# EAGLE schematic smartcardemu (EAGLE 6.5.0)
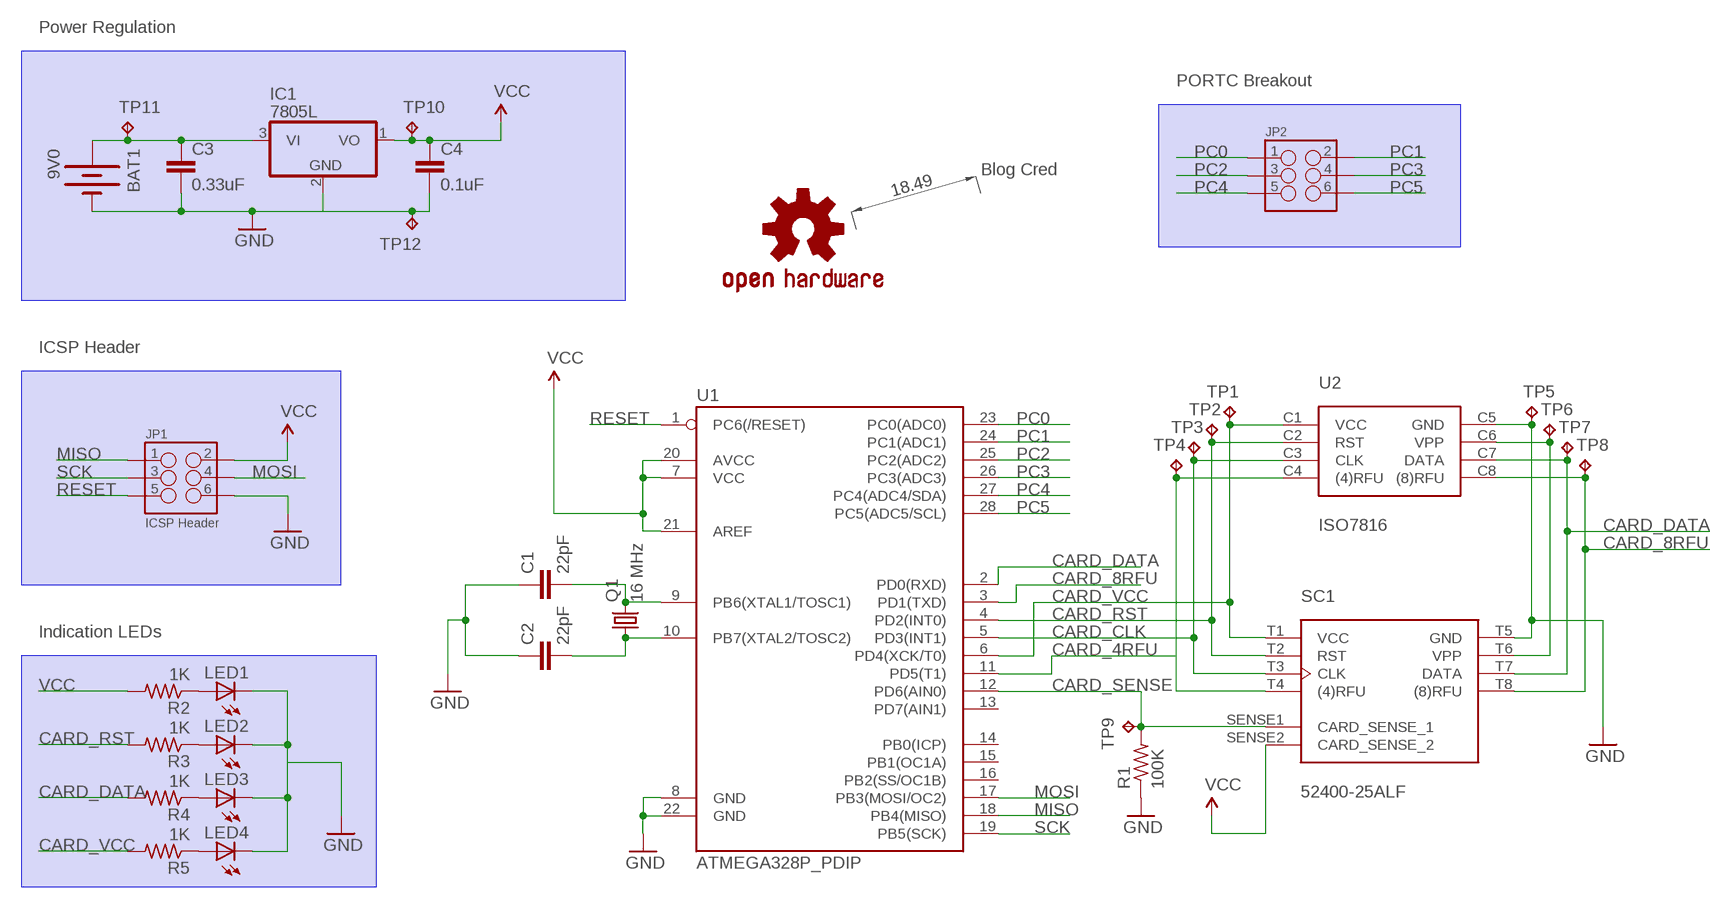
[diagram p0: schematic, sheet 1]

## Parts
BAT1  9V0  BATTERY9V  [BATTCON_9V]
C1  22pF  CAPPTH  [CAP-PTH-SMALL]
C2  22pF  CAPPTH  [CAP-PTH-SMALL]
C3  0.33uF  CAPPTH  [CAP-PTH-SMALL]
C4  0.1uF  CAPPTH  [CAP-PTH-SMALL]
IC1  7805L  [TO92]
JP1  ICSP Header  M03X2NO_SILK  [2X3-NS]
JP2  M03X2POGO_PINS  [2X3_POGO]
LED1  LED5MM  [LED5MM]
LED2  LED5MM  [LED5MM]
LED3  LED5MM  [LED5MM]
LED4  LED5MM  [LED5MM]
LOGO1  OSHW-LOGOS  [OSHW-LOGO-S]
Q1  16 MHz  CRYSTALHC49S  [HC49/S]
R1  100K  FLIPFLOP-RES  [0805-THM]
R2  1K  FLIPFLOP-RES  [0805-THM]
R3  1K  FLIPFLOP-RES  [0805-THM]
R4  1K  FLIPFLOP-RES  [0805-THM]
R5  1K  FLIPFLOP-RES  [0805-THM]
SC1  52400-25ALF  [52400-25ALF]
TP1  TPPAD1-20  [P1-20]
TP2  TPPAD1-20  [P1-20]
TP3  TPPAD1-20  [P1-20]
TP4  TPPAD1-20  [P1-20]
TP5  TPPAD1-20  [P1-20]
TP6  TPPAD1-20  [P1-20]
TP7  TPPAD1-20  [P1-20]
TP8  TPPAD1-20  [P1-20]
TP9  TPPAD1-20  [P1-20]
TP10  TPPAD1-20  [P1-20]
TP11  TPPAD1-20  [P1-20]
TP12  TPPAD1-20  [P1-20]
U1  ATMEGA328P_PDIP  [DIL28-3]
U2  ISO7816  [ISO7816-2]

## Nets
CARD_4RFU: SC1.T4((4)RFU) TP4.TP U1.11(PD5(T1)) U2.C4((4)RFU)
CARD_8RFU: SC1.T8((8)RFU) TP8.TP U1.3(PD1(TXD)) U2.C8((8)RFU)
CARD_CLK: SC1.T3(CLK) TP3.TP U1.5(PD3(INT1)) U2.C3(CLK)
CARD_DATA: R4.2 SC1.T7(DATA) TP7.TP U1.2(PD0(RXD)) U2.C7(DATA)
CARD_RST: R3.2 SC1.T2(RST) TP2.TP U1.4(PD2(INT0)) U2.C2(RST)
CARD_SENSE: R1.2 SC1.SENSE1(CARD_SENSE_1) TP9.TP U1.12(PD6(AIN0))
CARD_VCC: R5.2 SC1.T1(VCC) TP1.TP U1.6(PD4(XCK/T0)) U2.C1(VCC)
GND: BAT1.- C1.1 C2.1 C3.2 C4.2 IC1.2(GND) JP1.6 LED1.K(C) LED2.K(C) LED3.K(C) LED4.K(C) R1.1 SC1.T5(GND) TP5.TP TP12.TP U1.8(GND) U1.22(GND) U2.C5(GND)
MISO: JP1.1 U1.18(PB4(MISO))
MOSI: JP1.4 U1.17(PB3(MOSI/OC2))
N$1: C1.2 Q1.2 U1.9(PB6(XTAL1/TOSC1))
N$2: C2.2 Q1.1 U1.10(PB7(XTAL2/TOSC2))
N$3: LED1.A R2.1
N$4: BAT1.+ C3.1 IC1.3(VI) TP11.TP
N$5: LED2.A R3.1
N$6: LED3.A R4.1
N$7: LED4.A R5.1
N$9: SC1.T6(VPP) TP6.TP U2.C6(VPP)
PC0: JP2.P$1
RESET: JP1.5 U1.1(PC6(/RESET))
SCK: JP1.3 U1.19(PB5(SCK))
VCC: C4.1 IC1.1(VO) JP1.2 R2.2 SC1.SENSE2(CARD_SENSE_2) TP10.TP U1.7(VCC) U1.20(AVCC) U1.21(AREF)
Unconnected: JP2.P$2 JP2.P$3 JP2.P$4 JP2.P$5 JP2.P$6 U1.13(PD7(AIN1)) U1.14(PB0(ICP)) U1.15(PB1(OC1A)) U1.16(PB2(SS/OC1B)) U1.23(PC0(ADC0)) U1.24(PC1(ADC1)) U1.25(PC2(ADC2)) U1.26(PC3(ADC3)) U1.27(PC4(ADC4/SDA)) U1.28(PC5(ADC5/SCL))

## Notes on the sheet
- Power Regulation
- PORTC Breakout
- Blog Cred
- ICSP Header
- Indication LEDs

## Library data of the parts
BAT1 = SparkFun-Electromechanical:BATTERY: Battery Holders Various common sizes : AA, AAA, 20mm coin cell and 12mm coin cell. 20MM_4LEGS, BATT-10373
C1-C4 = SparkFun-Capacitors:CAP: Capacitor Standard 0603 ceramic capacitor, and 0.1" leaded capacitor.
IC1 = adafruit:78*: Positive VOLTAGE REGULATOR Added bigger pads to the TO-92 package
JP1 = SparkFun-Connectors:M03X2: 2x3 .1" header. Shrouded, with keying- CONN-10681 SMT- CONN-11415 Pogo pins- HW-11044
JP2 = SparkFun-Connectors:M03X2: 2x3 .1" header. Shrouded, with keying- CONN-10681 SMT- CONN-11415 Pogo pins- HW-11044; PROD_ID: HW-11044
LED1-LED4 = led:LED: LED OSRAM: - CHIPLED LG R971, LG N971, LY N971, LG Q971, LY Q971, LO R971, LY R971 LH N974, LH R974 LS Q976, LO Q976, LY Q976 LO Q996 - Hyper CHIPLED LW Q18S LB Q993, LB Q99A, LB R99A - SideLED LS A670, LO A670, LY A670, LG A670, LP A670 LB A673, LV A673, LT A673, LW A673 LH A674 LY A675 LS A676, LA A676, LO A676, LY A676, LW A676 LS A679, LY A679, LG A679 - Hyper Micro SIDELED® LS Y876, LA Y876, LO Y876, LY Y876 LT Y87S - SmartLED LW L88C, LW L88S LB L89C, LB L89S, LG L890 LS L89K, LO L89K, LY L89K LS L896, LA L896, LO L896, LY L896 - TOPLED LS T670, LO T670, LY T670, LG T670, LP T670 LSG T670, LSP T670, LSY T670, LOP T670, LYG T670 LG T671, LOG T671, LSG T671 LB T673, LV T673, LT T673, LW T673 LH T674 LS T676, LA T676, LO T676, LY T676, LB T676, LH T676, LSB T676, LW T676 LB T67C, LV T67C, LT T67C, LS T67K, LO T67K, LY T67K, LW E67C LS E67B, LA E67B, LO E67B, LY E67B, LB E67C, LV E67C, LT E67C LW T67C LS T679, LY T679, LG T679 LS T770, LO T770, LY T770, LG T770, LP T770 LB T773, LV T773, LT T773, LW T773 LH T774 LS E675, LA E675, LY E675, LS T675 LS T776, LA T776, LO T776, LY T776, LB T776 LHGB T686 LT T68C, LB T68C - Hyper Mini TOPLED® LB M676 - Mini TOPLED Santana® LG M470 LS M47K, LO M47K, LY M47K Source: http://www.osram.convergy.de LUXEON: - LUMILED® LXK2-PW12-R00, LXK2-PW12-S00, LXK2-PW14-U00, LXK2-PW14-V00 LXK2-PM12-R00, LXK2-PM12-S00, LXK2-PM14-U00 LXK2-PE12-Q00, LXK2-PE12-R00, LXK2-PE12-S00, LXK2-PE14-T00, LXK2-PE14-U00 LXK2-PB12-K00, LXK2-PB12-L00, LXK2-PB12-M00, LXK2-PB14-N00, LXK2-PB14-P00, LXK2-PB14-Q00 LXK2-PR12-L00, LXK2-PR12-M00, LXK2-PR14-Q00, LXK2-PR14-R00 LXK2-PD12-Q00, LXK2-PD12-R00, LXK2-PD12-S00 LXK2-PH12-R00, LXK2-PH12-S00 LXK2-PL12-P00, LXK2-PL12-Q00, LXK2-PL12-R00 Source: www.luxeon.com KINGBRIGHT: KA-3528ASYC Source: www.kingbright.com
LOGO1 = SparkFun-Aesthetics:OSHW-LOGO: Open Source Hardware Logo This logo indicates the piece of hardware it is found on incorporates a OSHW license and/or adheres to the definition of open source hardware found here: http://freedomdefined.org/OSHW
Q1 = adafruit:CRYSTAL: CRYSTAL; OC_FARNELL: 1667008; OC_NEWARK: unknown
R1-R5 = adafruit:FLIPFLOP-RES: Flip Flop resistor An 0805 resistor inside a standard 1/4W 5% resistor. Makes for easy mods
SC1 = ass-hat:52400-25ALF: FCI Smart Card Connector 10 (8+2) Position Push In, Pull Out
TP1-TP12 = testpad:TP: Test pad
U1 = SparkFun-DigitalIC:ATMEGA328P_PDIP: uC used in the Arduino 32kb flash, 1k EEPROM, 2k SRAM This is the through-hole version of this chip.
U2 = ass-hat:ISO7816